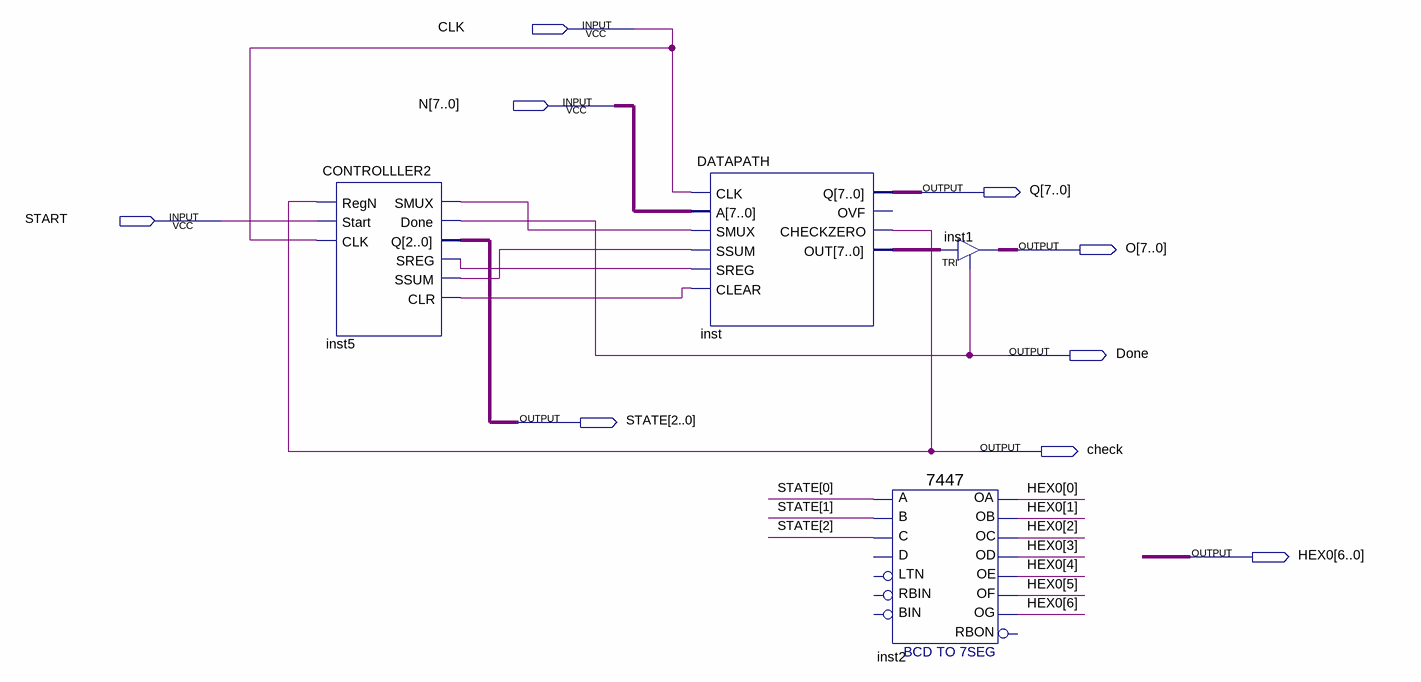
[diagram p0: schematic sheet]
// Quartus schematic MAIN.bdf as structural Verilog: 4 symbols, 9 pins
module MAIN (
  input  CLK,
  input  [7:0] N,
  input  START,
  output [7:0] Q,
  output [7:0] O,
  output Done,
  output [2:0] STATE,
  output check,
  output [6:0] HEX0
);

  wire inst5_clr, inst5_smux, inst5_sreg, inst5_ssum;
  wire [7:0] inst_out;

  CONTROLLLER2 inst5 (
    .RegN(check), .Start(START), .CLK(CLK), .SMUX(inst5_smux), .Done(Done), .Q(STATE), .SREG(inst5_sreg),
    .SSUM(inst5_ssum), .CLR(inst5_clr));
  DATAPATH inst (
    .CLK(CLK), .A(N), .SMUX(inst5_smux), .SSUM(inst5_ssum), .SREG(inst5_sreg), .CLEAR(inst5_clr), .Q(Q),
    .CHECKZERO(check), .OUT(inst_out));  // open: OVF
  \7447  inst2 (
    .B(STATE[1]), .C(STATE[2]), .A(STATE[0]), .OB(HEX0[1]), .OC(HEX0[2]), .OE(HEX0[4]), .OD(HEX0[3]),
    .OF(HEX0[5]), .OG(HEX0[6]), .OA(HEX0[0]));  // open: LTN, D, RBIN, BIN, RBON
  TRI inst1[7:0] (.IN(inst_out), .OE(Done), .OUT(O));
endmodule
